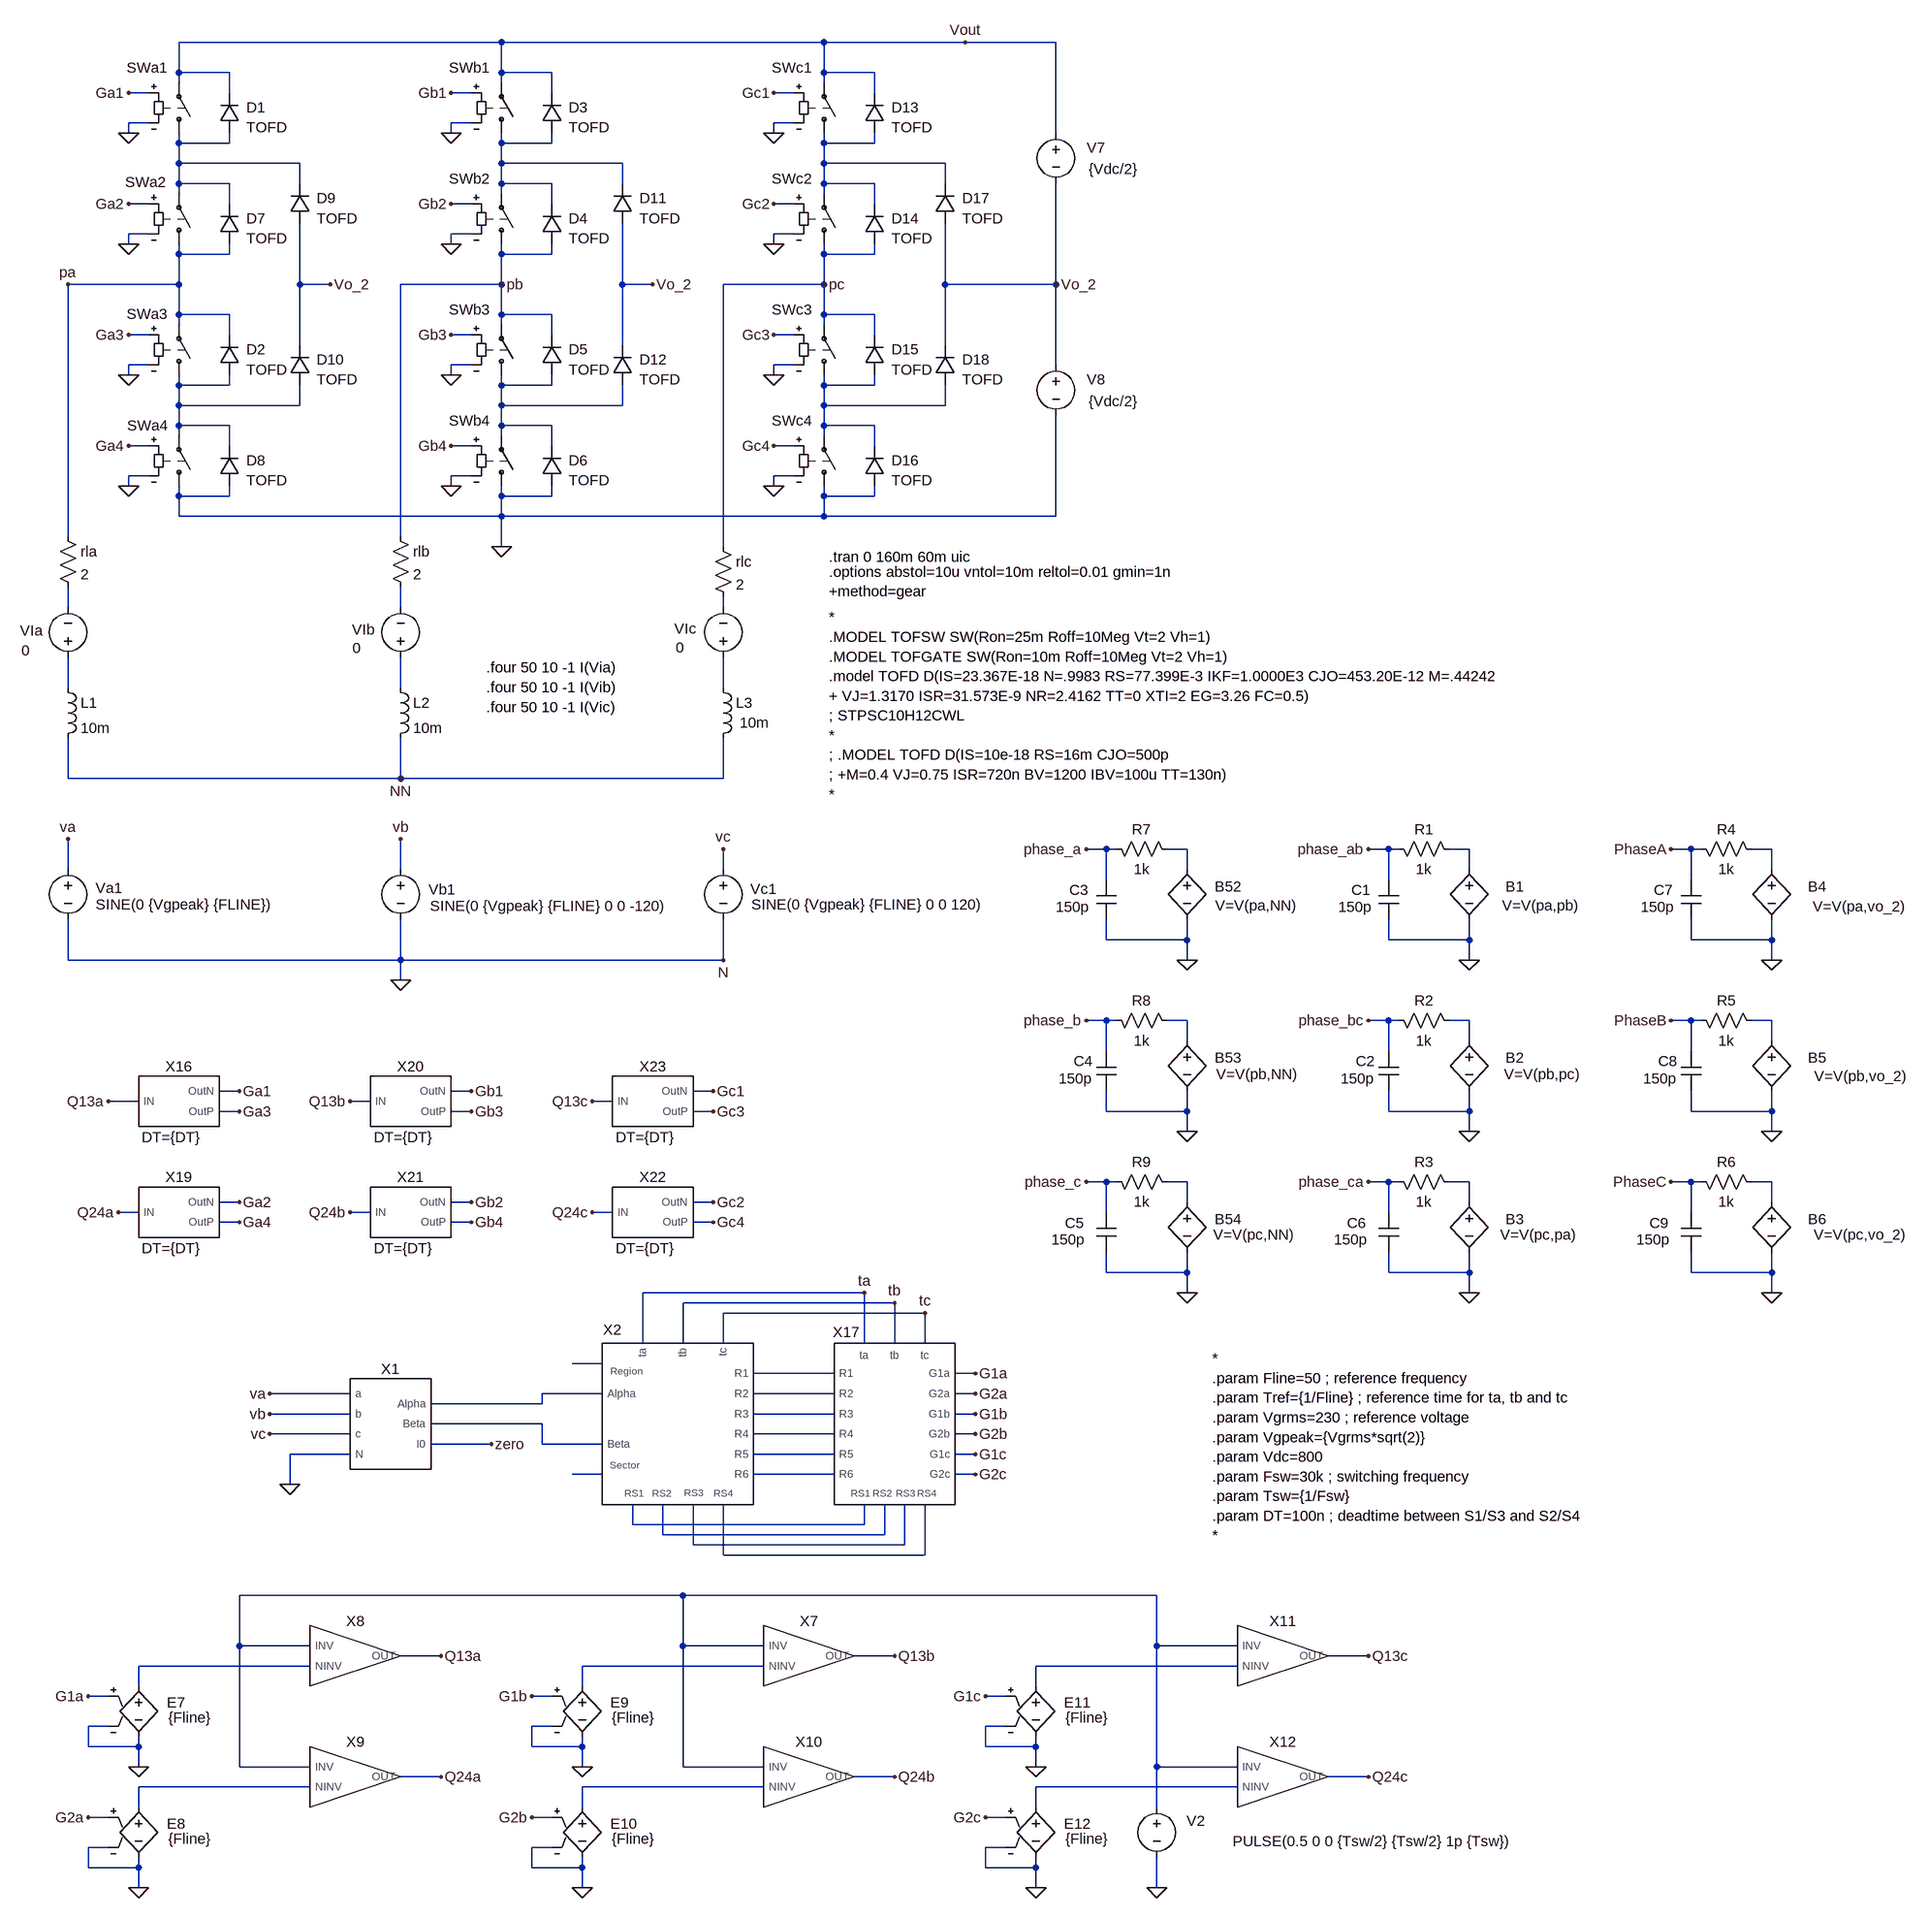
[diagram p0: schematic 3-phase NPC open loop inverter with switches - SVM.asc]
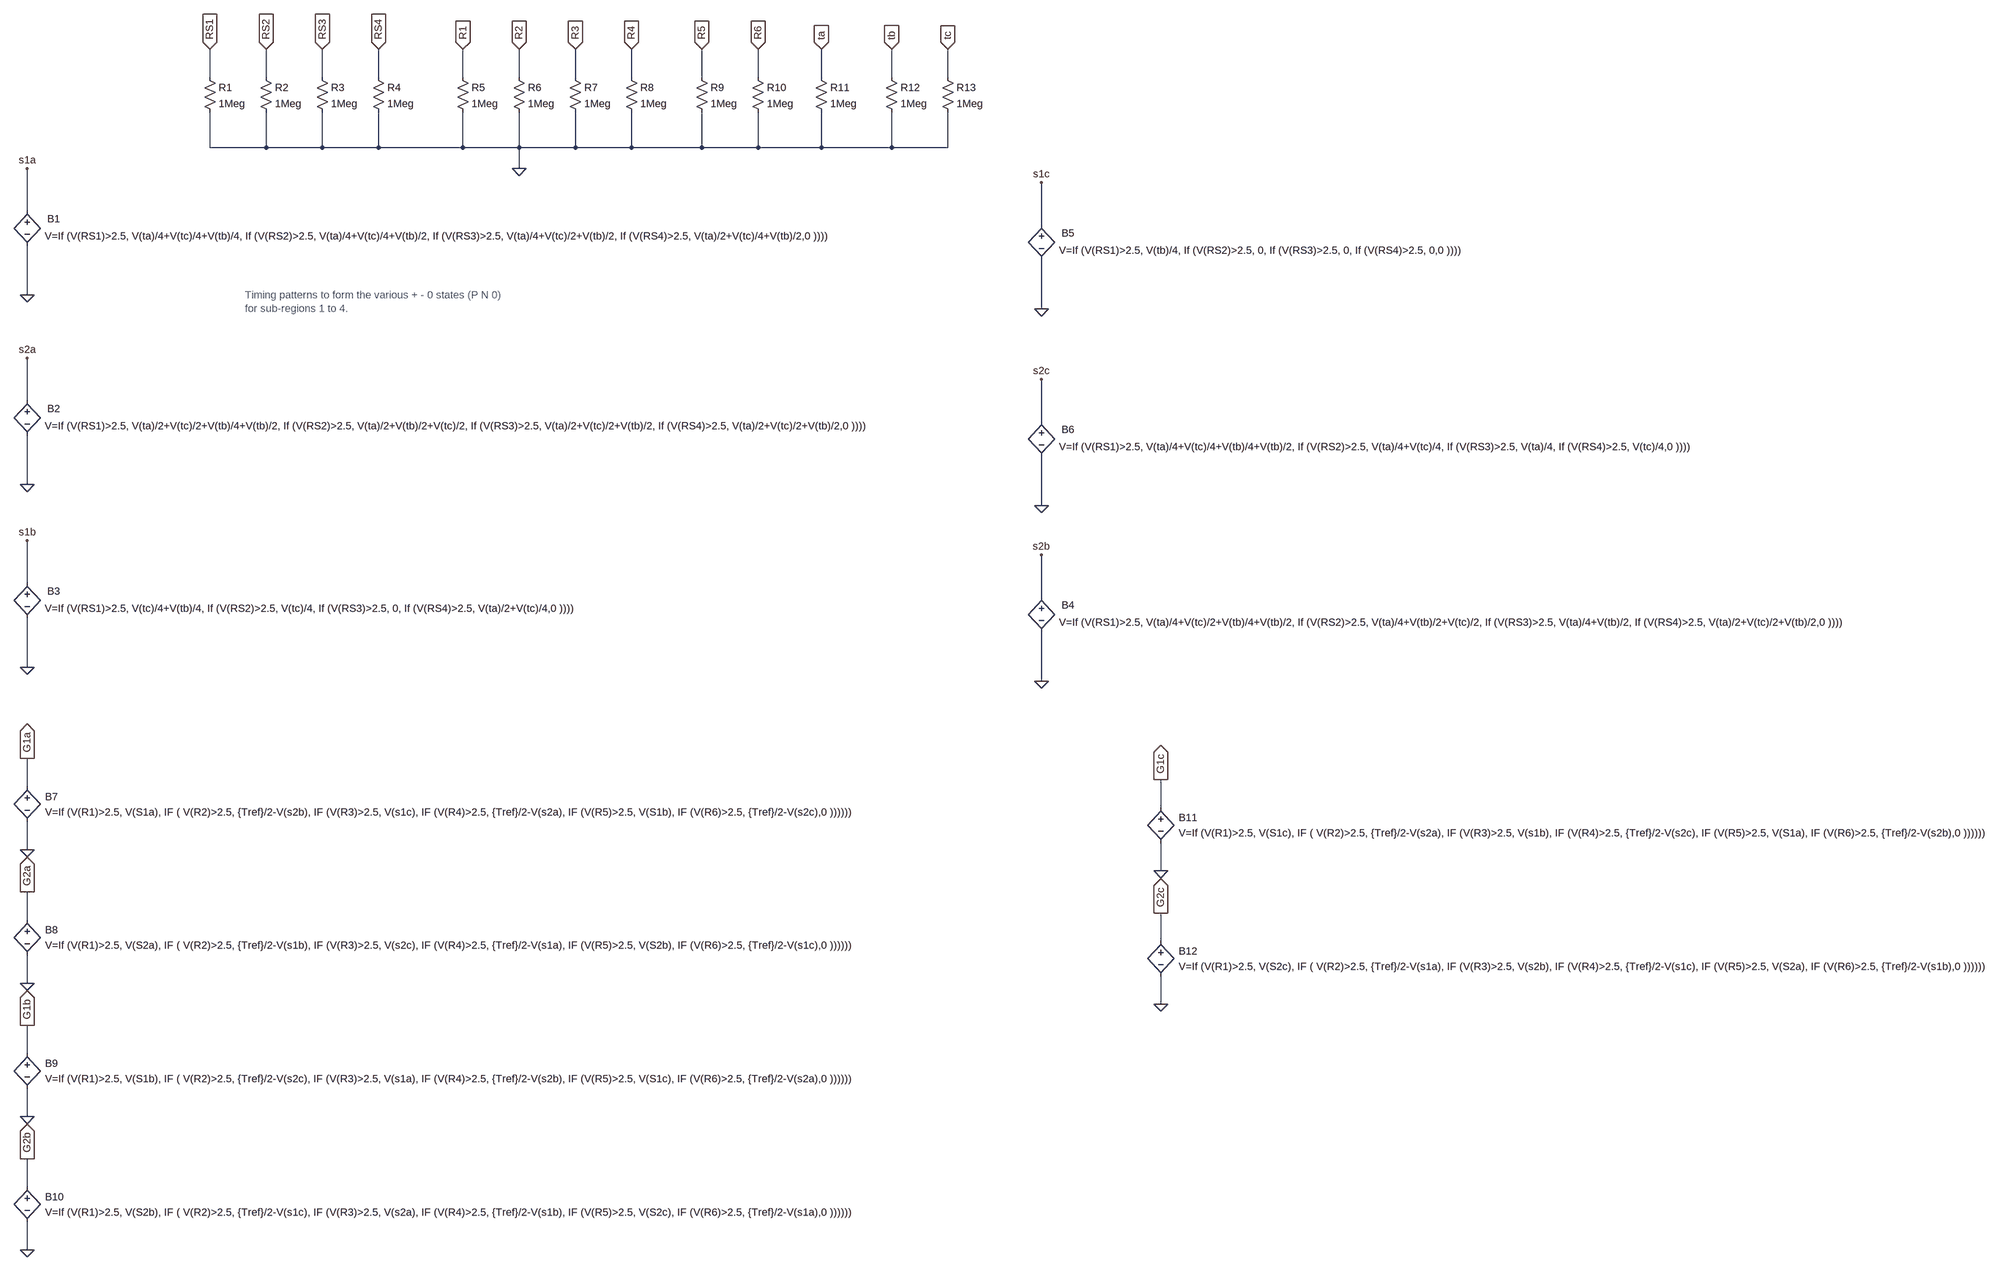
[diagram p1: sub-circuit timinggenerator.asc]
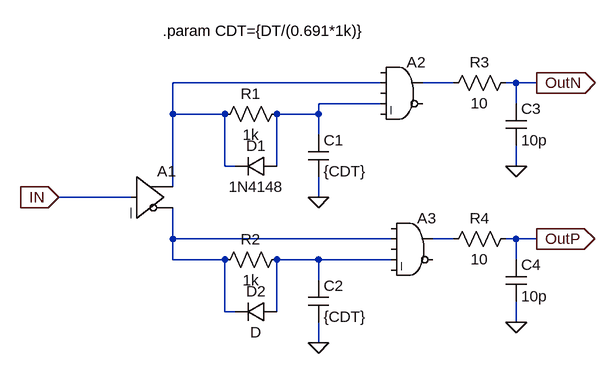
[diagram p2: sub-circuit dt_driver.asc]
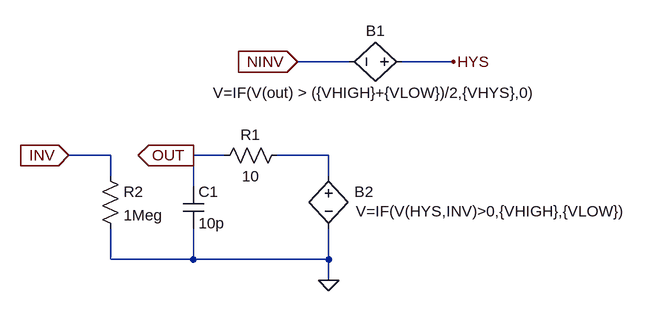
[diagram p3: sub-circuit comptof.asc]
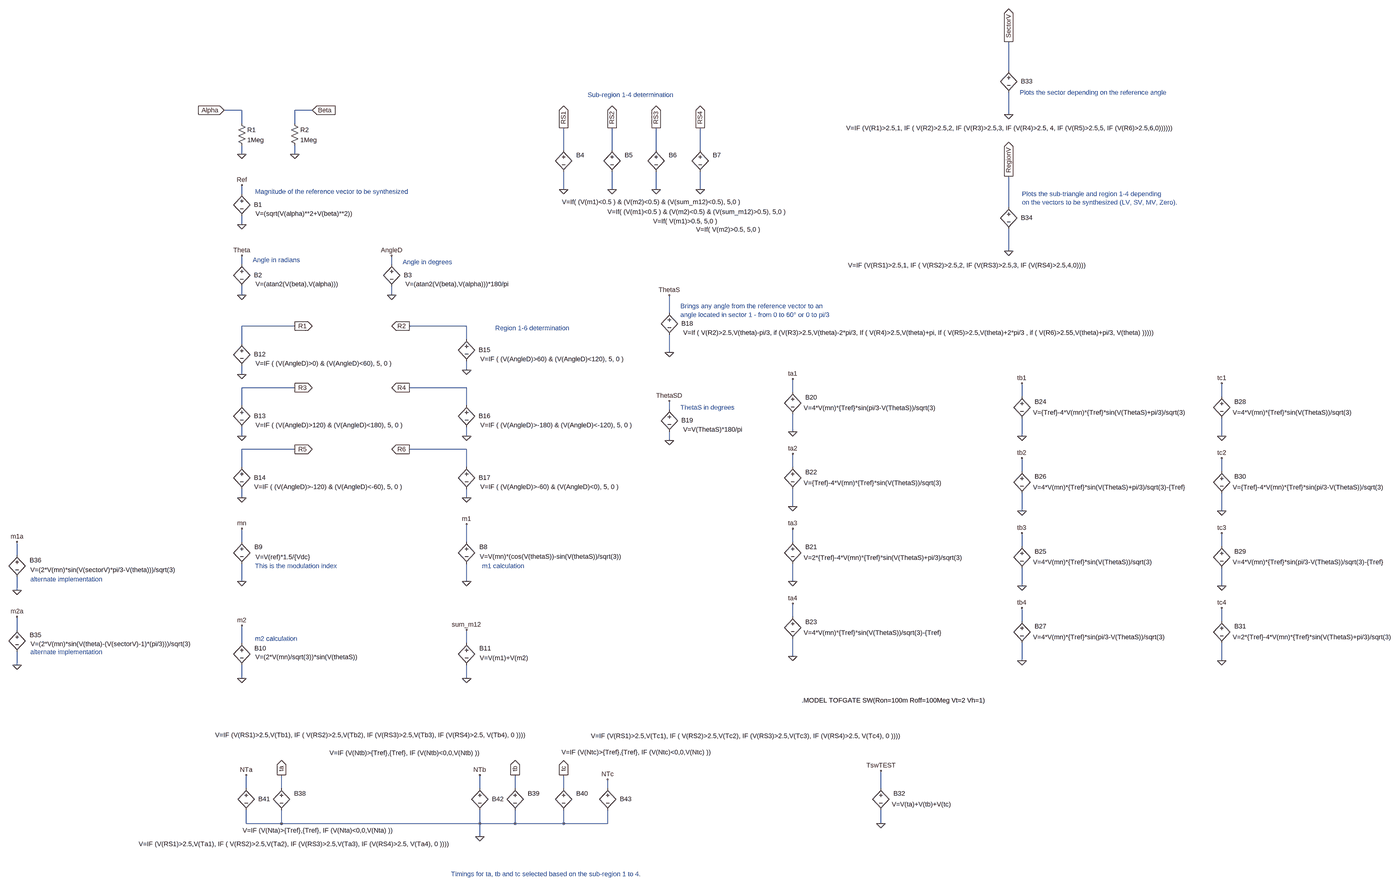
[diagram p4: sub-circuit alphabetatimings.asc, whole sheet]
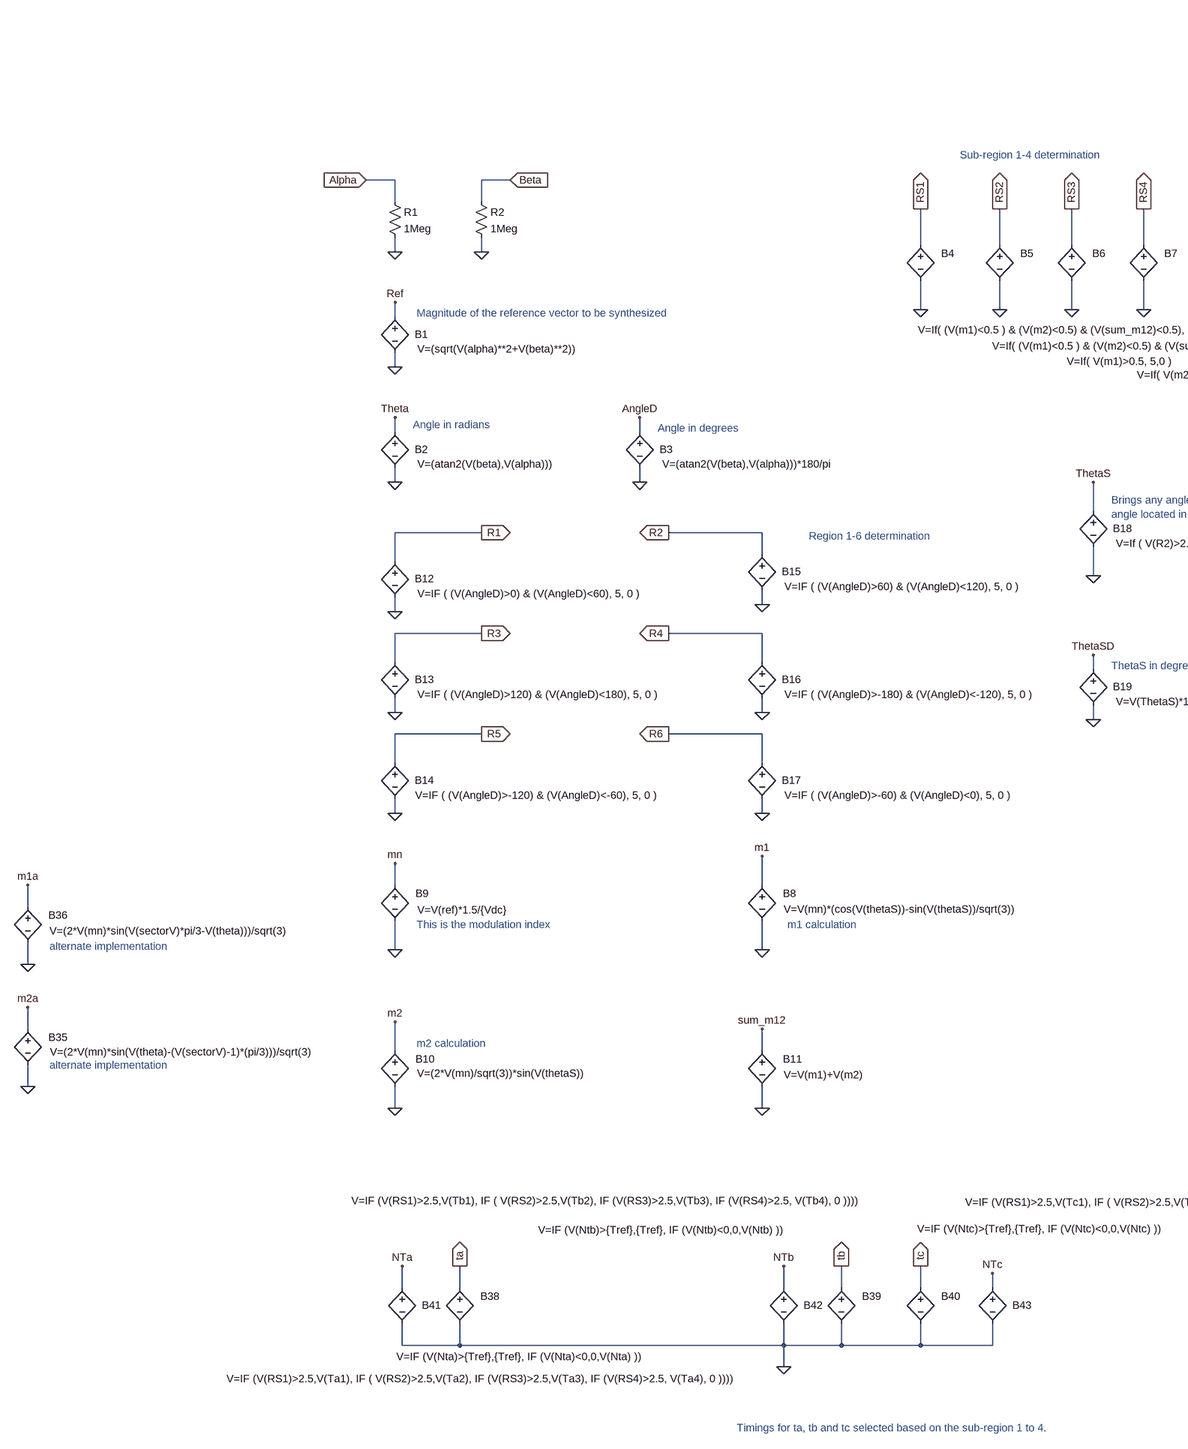
[diagram p5: sub-circuit alphabetatimings.asc, part, row 1 of 1, column 1 of 2]
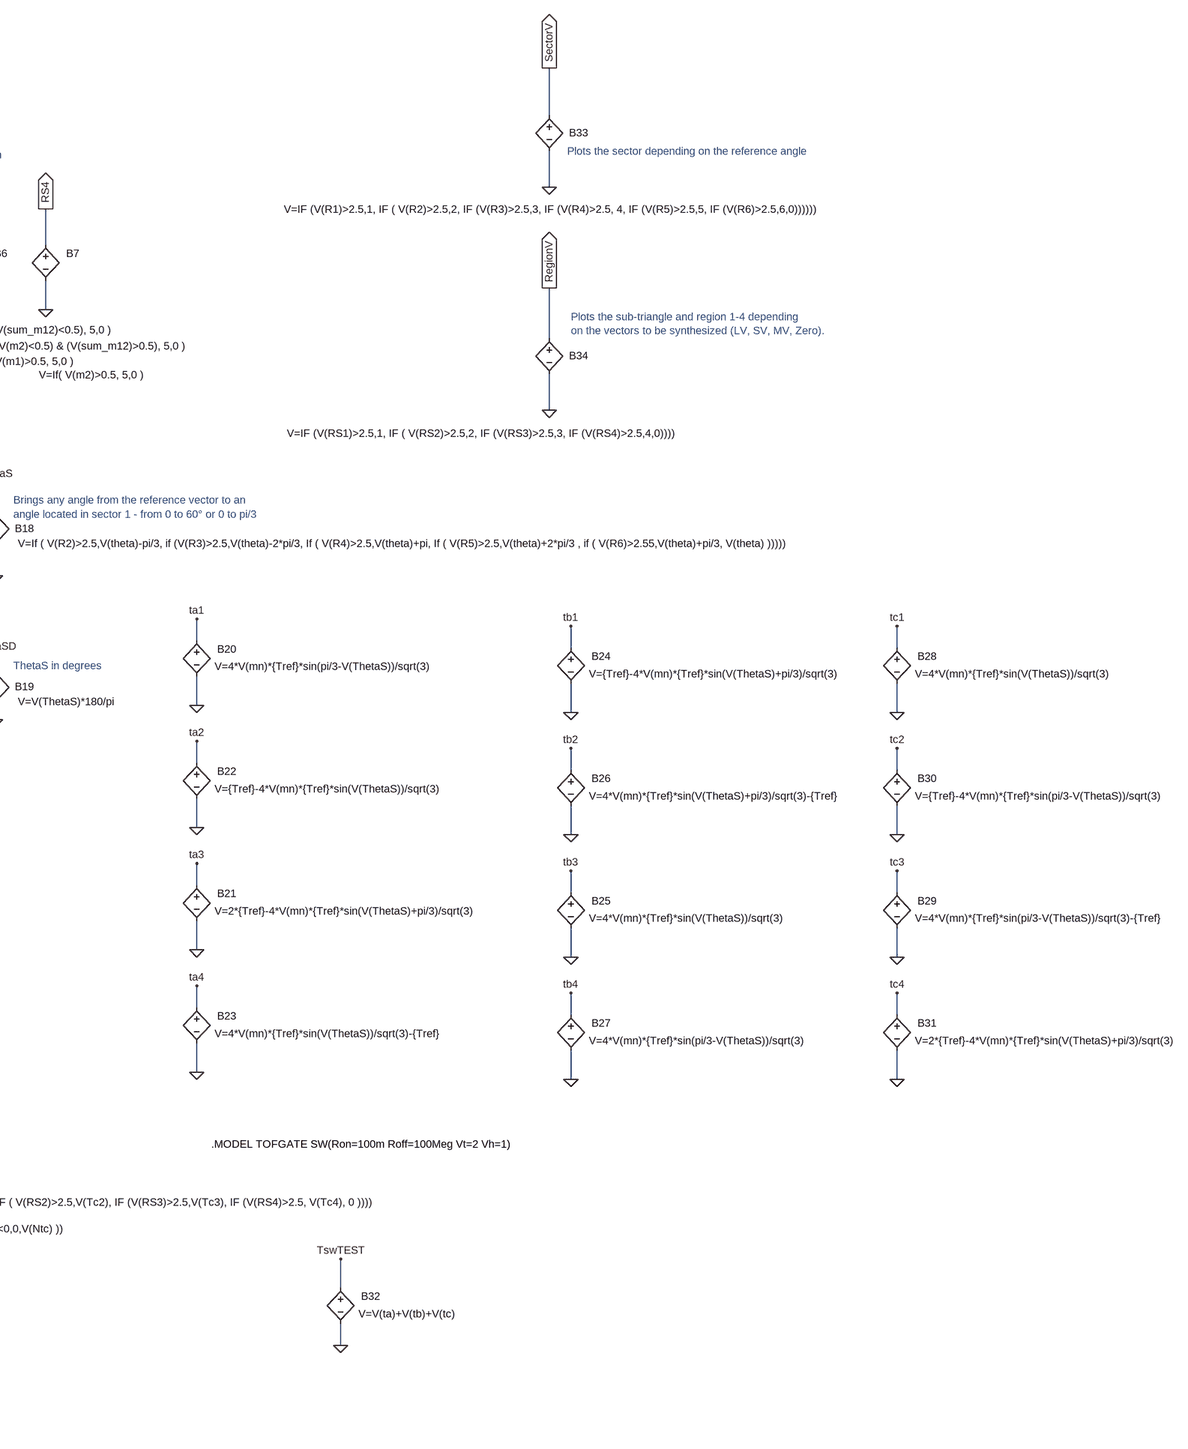
[diagram p6: sub-circuit alphabetatimings.asc, part, row 1 of 1, column 2 of 2]
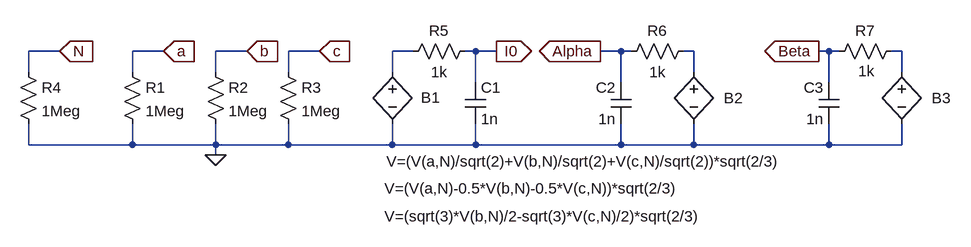
[diagram p7: sub-circuit abc_alpha_beta.asc]
3-phase NPC open loop inverter with switches - SVM.asc, the LTspice schematic file:
Version 4.1
SHEET 1 4820 6356
WIRE 496 -1056 -16 -1056
WIRE 1008 -1056 496 -1056
WIRE 1232 -1056 1008 -1056
WIRE 1376 -1056 1232 -1056
WIRE -16 -1008 -16 -1056
WIRE 64 -1008 -16 -1008
WIRE 496 -1008 496 -1056
WIRE 576 -1008 496 -1008
WIRE 1008 -1008 1008 -1056
WIRE 1088 -1008 1008 -1008
WIRE -16 -992 -16 -1008
WIRE 496 -992 496 -1008
WIRE 1008 -992 1008 -1008
WIRE -64 -976 -96 -976
WIRE 64 -976 64 -1008
WIRE 448 -976 416 -976
WIRE 576 -976 576 -1008
WIRE 960 -976 928 -976
WIRE 1088 -976 1088 -1008
WIRE -64 -928 -96 -928
WIRE 448 -928 416 -928
WIRE 960 -928 928 -928
WIRE -96 -912 -96 -928
WIRE 416 -912 416 -928
WIRE 928 -912 928 -928
WIRE 1376 -912 1376 -1056
WIRE -16 -896 -16 -912
WIRE 64 -896 64 -912
WIRE 64 -896 -16 -896
WIRE 496 -896 496 -912
WIRE 576 -896 576 -912
WIRE 576 -896 496 -896
WIRE 1008 -896 1008 -912
WIRE 1088 -896 1088 -912
WIRE 1088 -896 1008 -896
WIRE -16 -864 -16 -896
WIRE 176 -864 -16 -864
WIRE 496 -864 496 -896
WIRE 688 -864 496 -864
WIRE 1008 -864 1008 -896
WIRE 1200 -864 1008 -864
WIRE -16 -832 -16 -864
WIRE 64 -832 -16 -832
WIRE 176 -832 176 -864
WIRE 496 -832 496 -864
WIRE 576 -832 496 -832
WIRE 688 -832 688 -864
WIRE 1008 -832 1008 -864
WIRE 1088 -832 1008 -832
WIRE 1200 -832 1200 -864
WIRE -16 -816 -16 -832
WIRE 496 -816 496 -832
WIRE 1008 -816 1008 -832
WIRE -64 -800 -96 -800
WIRE 64 -800 64 -832
WIRE 448 -800 416 -800
WIRE 576 -800 576 -832
WIRE 960 -800 928 -800
WIRE 1088 -800 1088 -832
WIRE -64 -752 -96 -752
WIRE 448 -752 416 -752
WIRE 960 -752 928 -752
WIRE -96 -736 -96 -752
WIRE 416 -736 416 -752
WIRE 928 -736 928 -752
WIRE -16 -720 -16 -736
WIRE 64 -720 64 -736
WIRE 64 -720 -16 -720
WIRE 496 -720 496 -736
WIRE 576 -720 576 -736
WIRE 576 -720 496 -720
WIRE 1008 -720 1008 -736
WIRE 1088 -720 1088 -736
WIRE 1088 -720 1008 -720
WIRE -16 -672 -16 -720
WIRE -16 -672 -192 -672
WIRE 176 -672 176 -768
WIRE 224 -672 176 -672
WIRE 496 -672 496 -720
WIRE 496 -672 336 -672
WIRE 688 -672 688 -768
WIRE 736 -672 688 -672
WIRE 1008 -672 1008 -720
WIRE 1008 -672 848 -672
WIRE 1200 -672 1200 -768
WIRE 1376 -672 1376 -832
WIRE 1376 -672 1200 -672
WIRE -16 -624 -16 -672
WIRE 64 -624 -16 -624
WIRE 496 -624 496 -672
WIRE 576 -624 496 -624
WIRE 1008 -624 1008 -672
WIRE 1088 -624 1008 -624
WIRE -16 -608 -16 -624
WIRE 496 -608 496 -624
WIRE 1008 -608 1008 -624
WIRE -64 -592 -96 -592
WIRE 64 -592 64 -624
WIRE 448 -592 416 -592
WIRE 576 -592 576 -624
WIRE 960 -592 928 -592
WIRE 1088 -592 1088 -624
WIRE 176 -576 176 -672
WIRE 688 -576 688 -672
WIRE 1200 -576 1200 -672
WIRE -64 -544 -96 -544
WIRE 448 -544 416 -544
WIRE 960 -544 928 -544
WIRE 1376 -544 1376 -672
WIRE -96 -528 -96 -544
WIRE 416 -528 416 -544
WIRE 928 -528 928 -544
WIRE -16 -512 -16 -528
WIRE 64 -512 64 -528
WIRE 64 -512 -16 -512
WIRE 496 -512 496 -528
WIRE 576 -512 576 -528
WIRE 576 -512 496 -512
WIRE 1008 -512 1008 -528
WIRE 1088 -512 1088 -528
WIRE 1088 -512 1008 -512
WIRE -16 -480 -16 -512
WIRE 176 -480 176 -512
WIRE 176 -480 -16 -480
WIRE 496 -480 496 -512
WIRE 688 -480 688 -512
WIRE 688 -480 496 -480
WIRE 1008 -480 1008 -512
WIRE 1200 -480 1200 -512
WIRE 1200 -480 1008 -480
WIRE -16 -448 -16 -480
WIRE 64 -448 -16 -448
WIRE 496 -448 496 -480
WIRE 576 -448 496 -448
WIRE 1008 -448 1008 -480
WIRE 1088 -448 1008 -448
WIRE -16 -432 -16 -448
WIRE 496 -432 496 -448
WIRE 1008 -432 1008 -448
WIRE -64 -416 -96 -416
WIRE 64 -416 64 -448
WIRE 448 -416 416 -416
WIRE 576 -416 576 -448
WIRE 960 -416 928 -416
WIRE 1088 -416 1088 -448
WIRE -64 -368 -96 -368
WIRE 448 -368 416 -368
WIRE 960 -368 928 -368
WIRE -96 -352 -96 -368
WIRE 416 -352 416 -368
WIRE 928 -352 928 -368
WIRE -16 -336 -16 -352
WIRE 64 -336 64 -352
WIRE 64 -336 -16 -336
WIRE 496 -336 496 -352
WIRE 576 -336 576 -352
WIRE 576 -336 496 -336
WIRE 1008 -336 1008 -352
WIRE 1088 -336 1088 -352
WIRE 1088 -336 1008 -336
WIRE -16 -304 -16 -336
WIRE 496 -304 496 -336
WIRE 496 -304 -16 -304
WIRE 1008 -304 1008 -336
WIRE 1008 -304 496 -304
WIRE 1376 -304 1376 -464
WIRE 1376 -304 1008 -304
WIRE -192 -272 -192 -672
WIRE 336 -272 336 -672
WIRE 496 -256 496 -304
WIRE 848 -256 848 -672
WIRE -192 -160 -192 -192
WIRE 336 -160 336 -192
WIRE 848 -160 848 -176
WIRE -192 -32 -192 -80
WIRE 336 -32 336 -80
WIRE 848 -32 848 -80
WIRE -192 112 -192 48
WIRE 336 112 336 48
WIRE 336 112 -192 112
WIRE 848 112 848 48
WIRE 848 112 336 112
WIRE 1456 224 1424 224
WIRE 1472 224 1456 224
WIRE 1584 224 1552 224
WIRE 1904 224 1872 224
WIRE 1920 224 1904 224
WIRE 2032 224 2000 224
WIRE 2384 224 2352 224
WIRE 2400 224 2384 224
WIRE 2512 224 2480 224
WIRE -192 256 -192 208
WIRE 336 256 336 208
WIRE 848 256 848 224
WIRE 1584 256 1584 224
WIRE 2032 256 2032 224
WIRE 2512 256 2512 224
WIRE 1456 272 1456 224
WIRE 1904 272 1904 224
WIRE 2384 272 2384 224
WIRE 1456 368 1456 336
WIRE 1584 368 1584 336
WIRE 1584 368 1456 368
WIRE 1904 368 1904 336
WIRE 2032 368 2032 336
WIRE 2032 368 1904 368
WIRE 2384 368 2384 336
WIRE 2512 368 2512 336
WIRE 2512 368 2384 368
WIRE -192 400 -192 336
WIRE 336 400 336 336
WIRE 336 400 -192 400
WIRE 848 400 848 336
WIRE 848 400 336 400
WIRE 1584 400 1584 368
WIRE 2032 400 2032 368
WIRE 2512 400 2512 368
WIRE 336 432 336 400
WIRE 1456 496 1424 496
WIRE 1472 496 1456 496
WIRE 1584 496 1552 496
WIRE 1904 496 1872 496
WIRE 1920 496 1904 496
WIRE 2032 496 2000 496
WIRE 2384 496 2352 496
WIRE 2400 496 2384 496
WIRE 2512 496 2480 496
WIRE 1584 528 1584 496
WIRE 2032 528 2032 496
WIRE 2512 528 2512 496
WIRE 1456 544 1456 496
WIRE 1904 544 1904 496
WIRE 2384 544 2384 496
WIRE 80 608 48 608
WIRE 448 608 416 608
WIRE 832 608 800 608
WIRE -80 624 -128 624
WIRE 288 624 256 624
WIRE 672 624 640 624
WIRE 80 640 48 640
WIRE 448 640 416 640
WIRE 832 640 800 640
WIRE 1456 640 1456 608
WIRE 1584 640 1584 608
WIRE 1584 640 1456 640
WIRE 1904 640 1904 608
WIRE 2032 640 2032 608
WIRE 2032 640 1904 640
WIRE 2384 640 2384 608
WIRE 2512 640 2512 608
WIRE 2512 640 2384 640
WIRE 1584 672 1584 640
WIRE 2032 672 2032 640
WIRE 2512 672 2512 640
WIRE 1456 752 1424 752
WIRE 1472 752 1456 752
WIRE 1584 752 1552 752
WIRE 1904 752 1872 752
WIRE 1920 752 1904 752
WIRE 2032 752 2000 752
WIRE 2384 752 2352 752
WIRE 2400 752 2384 752
WIRE 2512 752 2480 752
WIRE 80 784 48 784
WIRE 448 784 416 784
WIRE 832 784 800 784
WIRE 1584 784 1584 752
WIRE 2032 784 2032 752
WIRE 2512 784 2512 752
WIRE -80 800 -112 800
WIRE 288 800 256 800
WIRE 672 800 640 800
WIRE 1456 800 1456 752
WIRE 1904 800 1904 752
WIRE 2384 800 2384 752
WIRE 80 816 48 816
WIRE 448 816 416 816
WIRE 832 816 800 816
WIRE 1456 896 1456 864
WIRE 1584 896 1584 864
WIRE 1584 896 1456 896
WIRE 1904 896 1904 864
WIRE 2032 896 2032 864
WIRE 2032 896 1904 896
WIRE 2384 896 2384 864
WIRE 2512 896 2512 864
WIRE 2512 896 2384 896
WIRE 1072 928 720 928
WIRE 1584 928 1584 896
WIRE 2032 928 2032 896
WIRE 2512 928 2512 896
WIRE 1120 944 784 944
WIRE 1168 960 848 960
WIRE 720 1008 720 928
WIRE 784 1008 784 944
WIRE 848 1008 848 960
WIRE 1072 1008 1072 928
WIRE 1120 1008 1120 944
WIRE 1168 1008 1168 960
WIRE 656 1040 608 1040
WIRE 1024 1056 896 1056
WIRE 1248 1056 1216 1056
WIRE 256 1088 128 1088
WIRE 656 1088 560 1088
WIRE 1024 1088 896 1088
WIRE 1248 1088 1216 1088
WIRE 560 1104 560 1088
WIRE 560 1104 384 1104
WIRE 256 1120 128 1120
WIRE 1024 1120 896 1120
WIRE 1248 1120 1216 1120
WIRE 560 1136 384 1136
WIRE 256 1152 128 1152
WIRE 1024 1152 896 1152
WIRE 1248 1152 1216 1152
WIRE 480 1168 384 1168
WIRE 560 1168 560 1136
WIRE 656 1168 560 1168
WIRE 256 1184 160 1184
WIRE 1024 1184 896 1184
WIRE 1248 1184 1216 1184
WIRE 656 1216 608 1216
WIRE 1024 1216 896 1216
WIRE 1248 1216 1216 1216
WIRE 160 1232 160 1184
WIRE 704 1296 704 1264
WIRE 1072 1296 1072 1264
WIRE 1072 1296 704 1296
WIRE 752 1312 752 1264
WIRE 1104 1312 1104 1264
WIRE 1104 1312 752 1312
WIRE 800 1328 800 1264
WIRE 1136 1328 1136 1264
WIRE 1136 1328 800 1328
WIRE 848 1344 848 1264
WIRE 1168 1344 1168 1264
WIRE 1168 1344 848 1344
WIRE 784 1408 80 1408
WIRE 1536 1408 784 1408
WIRE 80 1488 80 1408
WIRE 192 1488 80 1488
WIRE 784 1488 784 1408
WIRE 912 1488 784 1488
WIRE 1536 1488 1536 1408
WIRE 1664 1488 1536 1488
WIRE 400 1504 336 1504
WIRE 1120 1504 1056 1504
WIRE 1872 1504 1808 1504
WIRE 192 1520 -80 1520
WIRE 912 1520 624 1520
WIRE 1664 1520 1344 1520
WIRE -80 1552 -80 1520
WIRE 624 1552 624 1520
WIRE 1344 1552 1344 1520
WIRE -128 1568 -160 1568
WIRE 576 1568 544 1568
WIRE 1296 1568 1264 1568
WIRE -128 1616 -160 1616
WIRE 576 1616 544 1616
WIRE 1296 1616 1264 1616
WIRE -160 1648 -160 1616
WIRE -80 1648 -80 1632
WIRE -80 1648 -160 1648
WIRE 544 1648 544 1616
WIRE 624 1648 624 1632
WIRE 624 1648 544 1648
WIRE 1264 1648 1264 1616
WIRE 1344 1648 1344 1632
WIRE 1344 1648 1264 1648
WIRE -80 1680 -80 1648
WIRE 80 1680 80 1488
WIRE 192 1680 80 1680
WIRE 624 1680 624 1648
WIRE 784 1680 784 1488
WIRE 912 1680 784 1680
WIRE 1344 1680 1344 1648
WIRE 1536 1680 1536 1488
WIRE 1664 1680 1536 1680
WIRE 400 1696 336 1696
WIRE 1120 1696 1056 1696
WIRE 1872 1696 1808 1696
WIRE 192 1712 -80 1712
WIRE 912 1712 624 1712
WIRE 1664 1712 1344 1712
WIRE -80 1744 -80 1712
WIRE 624 1744 624 1712
WIRE 1344 1744 1344 1712
WIRE 1536 1744 1536 1680
WIRE -128 1760 -160 1760
WIRE 576 1760 544 1760
WIRE 1296 1760 1264 1760
WIRE -128 1808 -160 1808
WIRE 576 1808 544 1808
WIRE 1296 1808 1264 1808
WIRE -160 1840 -160 1808
WIRE -80 1840 -80 1824
WIRE -80 1840 -160 1840
WIRE 544 1840 544 1808
WIRE 624 1840 624 1824
WIRE 624 1840 544 1840
WIRE 1264 1840 1264 1808
WIRE 1344 1840 1344 1824
WIRE 1344 1840 1264 1840
WIRE -80 1872 -80 1840
WIRE 624 1872 624 1840
WIRE 1344 1872 1344 1840
WIRE 1536 1872 1536 1824
FLAG 1232 -1056 Vout
FLAG -96 -352 0
FLAG -96 -528 0
FLAG -96 -736 0
FLAG -96 -912 0
FLAG 1376 -672 Vo_2
FLAG 224 -672 Vo_2
FLAG 416 -352 0
FLAG 416 -528 0
FLAG 416 -736 0
FLAG 416 -912 0
FLAG 736 -672 Vo_2
FLAG 928 -352 0
FLAG 928 -528 0
FLAG 928 -736 0
FLAG 928 -912 0
FLAG -96 -976 Ga1
FLAG -96 -800 Ga2
FLAG -96 -592 Ga3
FLAG -96 -416 Ga4
FLAG 416 -976 Gb1
FLAG 416 -800 Gb2
FLAG 416 -592 Gb3
FLAG 416 -416 Gb4
FLAG 928 -976 Gc1
FLAG 928 -800 Gc2
FLAG 928 -592 Gc3
FLAG 928 -416 Gc4
FLAG 496 -256 0
FLAG 1584 400 0
FLAG -192 -672 pa
FLAG 496 -672 pb
FLAG 1008 -672 pc
FLAG 336 112 NN
FLAG 1424 224 phase_a
FLAG 1584 672 0
FLAG 1424 496 phase_b
FLAG 1584 928 0
FLAG 1424 752 phase_c
FLAG 128 1088 va
FLAG 128 1120 vb
FLAG 128 1152 vc
FLAG 480 1168 zero
FLAG -192 208 va
FLAG 336 208 vb
FLAG 848 224 vc
FLAG 848 400 N
FLAG 1248 1056 G1a
FLAG 1248 1088 G2a
FLAG 1248 1120 G1b
FLAG 1248 1152 G2b
FLAG 1248 1184 G1c
FLAG 1248 1216 G2c
FLAG 80 640 Ga3
FLAG 80 608 Ga1
FLAG 80 816 Ga4
FLAG 80 784 Ga2
FLAG -128 624 Q13a
FLAG -112 800 Q24a
FLAG 448 640 Gb3
FLAG 448 608 Gb1
FLAG 448 816 Gb4
FLAG 448 784 Gb2
FLAG 256 624 Q13b
FLAG 256 800 Q24b
FLAG 832 640 Gc3
FLAG 832 608 Gc1
FLAG 832 816 Gc4
FLAG 832 784 Gc2
FLAG 640 624 Q13c
FLAG 640 800 Q24c
FLAG 1536 1872 0
FLAG 400 1504 Q13a
FLAG 400 1696 Q24a
FLAG 1120 1504 Q13b
FLAG 1120 1696 Q24b
FLAG 1872 1504 Q13c
FLAG 1872 1696 Q24c
FLAG -80 1680 0
FLAG -160 1568 G1a
FLAG -80 1872 0
FLAG -160 1760 G2a
FLAG 624 1680 0
FLAG 544 1568 G1b
FLAG 624 1872 0
FLAG 544 1760 G2b
FLAG 1344 1680 0
FLAG 1264 1568 G1c
FLAG 1344 1872 0
FLAG 1264 1760 G2c
FLAG 336 432 0
FLAG 2032 400 0
FLAG 1872 224 phase_ab
FLAG 2032 672 0
FLAG 1872 496 phase_bc
FLAG 2032 928 0
FLAG 1872 752 phase_ca
FLAG 160 1232 0
FLAG 1072 928 ta
FLAG 1120 944 tb
FLAG 1168 960 tc
FLAG 2512 400 0
FLAG 2352 224 PhaseA
FLAG 2512 672 0
FLAG 2352 496 PhaseB
FLAG 2512 928 0
FLAG 2352 752 PhaseC
SYMBOL res -208 -288 R0
SYMATTR InstName rla
SYMATTR Value 2
SYMBOL res 320 -288 R0
SYMATTR InstName rlb
SYMATTR Value 2
SYMBOL res 832 -272 R0
SYMATTR InstName rlc
SYMATTR Value 2
SYMBOL voltage -192 -64 R180
WINDOW 0 40 59 Left 2
WINDOW 3 60 27 Left 2
WINDOW 123 0 0 Left 0
WINDOW 39 0 0 Left 0
SYMATTR InstName VIa
SYMATTR Value 0
SYMBOL voltage 336 -64 R180
WINDOW 0 41 60 Left 2
WINDOW 3 63 31 Left 2
WINDOW 123 0 0 Left 0
WINDOW 39 0 0 Left 0
SYMATTR InstName VIb
SYMATTR Value 0
SYMBOL voltage 848 -64 R180
WINDOW 0 43 62 Left 2
WINDOW 3 62 32 Left 2
WINDOW 123 0 0 Left 0
WINDOW 39 0 0 Left 0
SYMATTR InstName VIc
SYMATTR Value 0
SYMBOL sw -16 -896 M180
WINDOW 3 47 44 Invisible 2
WINDOW 0 -83 120 Left 2
SYMATTR Value TOFSW
SYMATTR InstName SWa1
SYMBOL diode 48 -912 M180
WINDOW 0 43 41 Left 2
WINDOW 3 43 9 Left 2
SYMATTR InstName D1
SYMATTR Value TOFD
SYMBOL sw -16 -720 M180
WINDOW 3 47 44 Invisible 2
WINDOW 0 -85 114 Left 2
SYMATTR Value TOFSW
SYMATTR InstName SWa2
SYMBOL diode 48 -736 M180
WINDOW 0 43 41 Left 2
WINDOW 3 43 9 Left 2
SYMATTR InstName D7
SYMATTR Value TOFD
SYMBOL sw -16 -512 M180
WINDOW 3 47 44 Invisible 2
WINDOW 0 -83 113 Left 2
SYMATTR Value TOFSW
SYMATTR InstName SWa3
SYMBOL diode 48 -528 M180
WINDOW 0 43 41 Left 2
WINDOW 3 43 9 Left 2
SYMATTR InstName D2
SYMATTR Value TOFD
SYMBOL sw -16 -336 M180
WINDOW 3 47 44 Invisible 2
WINDOW 0 -82 112 Left 2
SYMATTR Value TOFSW
SYMATTR InstName SWa4
SYMBOL diode 48 -352 M180
WINDOW 0 43 41 Left 2
WINDOW 3 43 9 Left 2
SYMATTR InstName D8
SYMATTR Value TOFD
SYMBOL diode 160 -768 M180
WINDOW 0 43 41 Left 2
WINDOW 3 43 9 Left 2
SYMATTR InstName D9
SYMATTR Value TOFD
SYMBOL diode 160 -512 M180
WINDOW 0 43 41 Left 2
WINDOW 3 43 9 Left 2
SYMATTR InstName D10
SYMATTR Value TOFD
SYMBOL diode 560 -912 M180
WINDOW 0 43 41 Left 2
WINDOW 3 43 9 Left 2
SYMATTR InstName D3
SYMATTR Value TOFD
SYMBOL diode 560 -736 M180
WINDOW 0 43 41 Left 2
WINDOW 3 43 9 Left 2
SYMATTR InstName D4
SYMATTR Value TOFD
SYMBOL diode 560 -528 M180
WINDOW 0 43 41 Left 2
WINDOW 3 43 9 Left 2
SYMATTR InstName D5
SYMATTR Value TOFD
SYMBOL diode 560 -352 M180
WINDOW 0 43 41 Left 2
WINDOW 3 43 9 Left 2
SYMATTR InstName D6
SYMATTR Value TOFD
SYMBOL diode 672 -768 M180
WINDOW 0 43 41 Left 2
WINDOW 3 43 9 Left 2
SYMATTR InstName D11
SYMATTR Value TOFD
SYMBOL diode 672 -512 M180
WINDOW 0 43 41 Left 2
WINDOW 3 43 9 Left 2
SYMATTR InstName D12
SYMATTR Value TOFD
SYMBOL diode 1072 -912 M180
WINDOW 0 43 41 Left 2
WINDOW 3 43 9 Left 2
SYMATTR InstName D13
SYMATTR Value TOFD
SYMBOL diode 1072 -736 M180
WINDOW 0 43 41 Left 2
WINDOW 3 43 9 Left 2
SYMATTR InstName D14
SYMATTR Value TOFD
SYMBOL diode 1072 -528 M180
WINDOW 0 43 41 Left 2
WINDOW 3 43 9 Left 2
SYMATTR InstName D15
SYMATTR Value TOFD
SYMBOL diode 1072 -352 M180
WINDOW 0 43 41 Left 2
WINDOW 3 43 9 Left 2
SYMATTR InstName D16
SYMATTR Value TOFD
SYMBOL diode 1184 -768 M180
WINDOW 0 43 41 Left 2
WINDOW 3 43 9 Left 2
SYMATTR InstName D17
SYMATTR Value TOFD
SYMBOL diode 1184 -512 M180
WINDOW 0 43 41 Left 2
WINDOW 3 43 9 Left 2
SYMATTR InstName D18
SYMATTR Value TOFD
SYMBOL sw 496 -896 M180
WINDOW 3 47 44 Invisible 2
WINDOW 0 -83 120 Left 2
SYMATTR Value TOFSW
SYMATTR InstName SWb1
SYMBOL sw 496 -720 M180
WINDOW 3 47 44 Invisible 2
WINDOW 0 -83 120 Left 2
SYMATTR Value TOFSW
SYMATTR InstName SWb2
SYMBOL sw 496 -512 M180
WINDOW 3 47 44 Invisible 2
WINDOW 0 -83 120 Left 2
SYMATTR Value TOFSW
SYMATTR InstName SWb3
SYMBOL sw 496 -336 M180
WINDOW 3 47 44 Invisible 2
WINDOW 0 -83 120 Left 2
SYMATTR Value TOFSW
SYMATTR InstName SWb4
SYMBOL sw 1008 -896 M180
WINDOW 3 47 44 Invisible 2
WINDOW 0 -83 120 Left 2
SYMATTR Value TOFSW
SYMATTR InstName SWc1
SYMBOL sw 1008 -720 M180
WINDOW 3 47 44 Invisible 2
WINDOW 0 -83 120 Left 2
SYMATTR Value TOFSW
SYMATTR InstName SWc2
SYMBOL sw 1008 -512 M180
WINDOW 3 47 44 Invisible 2
WINDOW 0 -83 120 Left 2
SYMATTR Value TOFSW
SYMATTR InstName SWc3
SYMBOL sw 1008 -336 M180
WINDOW 3 47 44 Invisible 2
WINDOW 0 -83 120 Left 2
SYMATTR Value TOFSW
SYMATTR InstName SWc4
SYMBOL voltage 1376 -928 R0
WINDOW 0 49 39 Left 2
WINDOW 3 52 73 Left 2
SYMATTR InstName V7
SYMATTR Value {Vdc/2}
SYMBOL voltage 1376 -560 R0
WINDOW 0 49 39 Left 2
WINDOW 3 52 73 Left 2
SYMATTR InstName V8
SYMATTR Value {Vdc/2}
SYMBOL ind -208 -48 R0
SYMATTR InstName L1
SYMATTR Value 10m
SYMBOL ind 320 -48 R0
SYMATTR InstName L2
SYMATTR Value 10m
SYMBOL ind 832 -48 R0
WINDOW 3 42 71 Left 2
SYMATTR Value 10m
SYMATTR InstName L3
SYMBOL res 1456 208 M90
WINDOW 0 0 56 VBottom 2
WINDOW 3 32 56 VTop 2
SYMATTR InstName R7
SYMATTR Value 1k
SYMBOL cap 1472 272 M0
WINDOW 0 44 17 Left 2
WINDOW 3 42 44 Left 2
SYMATTR InstName C3
SYMATTR Value 150p
SYMBOL bv 1584 240 M0
WINDOW 0 -87 43 Left 2
WINDOW 3 -175 73 Left 2
SYMATTR InstName B52
SYMATTR Value V=V(pa,NN)
SYMBOL res 1456 480 M90
WINDOW 0 0 56 VBottom 2
WINDOW 3 32 56 VTop 2
SYMATTR InstName R8
SYMATTR Value 1k
SYMBOL cap 1472 544 M0
WINDOW 0 37 16 Left 2
WINDOW 3 38 44 Left 2
SYMATTR InstName C4
SYMATTR Value 150p
SYMBOL bv 1584 512 M0
WINDOW 0 -87 43 Left 2
WINDOW 3 -177 69 Left 2
SYMATTR InstName B53
SYMATTR Value V=V(pb,NN)
SYMBOL res 1456 736 M90
WINDOW 0 0 56 VBottom 2
WINDOW 3 32 56 VTop 2
SYMATTR InstName R9
SYMATTR Value 1k
SYMBOL cap 1472 800 M0
WINDOW 0 51 17 Left 2
WINDOW 3 49 43 Left 2
SYMATTR InstName C5
SYMATTR Value 150p
SYMBOL bv 1584 768 M0
WINDOW 0 -87 43 Left 2
WINDOW 3 -171 68 Left 2
SYMATTR InstName B54
SYMATTR Value V=V(pc,NN)
SYMBOL voltage -192 240 R0
WINDOW 0 44 46 Left 2
WINDOW 3 44 72 Left 2
WINDOW 123 0 0 Left 0
WINDOW 39 0 0 Left 0
SYMATTR InstName Va1
SYMATTR Value SINE(0 {Vgpeak} {FLINE})
SYMBOL voltage 336 240 R0
WINDOW 0 44 48 Left 2
WINDOW 3 47 74 Left 2
WINDOW 123 0 0 Left 0
WINDOW 39 0 0 Left 0
SYMATTR InstName Vb1
SYMATTR Value SINE(0 {Vgpeak} {FLINE} 0 0 -120)
SYMBOL voltage 848 240 R0
WINDOW 0 43 47 Left 2
WINDOW 3 45 72 Left 2
WINDOW 123 0 0 Left 0
WINDOW 39 0 0 Left 0
SYMATTR InstName Vc1
SYMATTR Value SINE(0 {Vgpeak} {FLINE} 0 0 120)
SYMBOL TOF\\3Phase\\SVM\\TimingGenerator 1088 1136 R0
WINDOW 0 -45 -130 Bottom 2
SYMATTR InstName X17
SYMATTR SpiceLine Tsw={Tsw} Tref={Tref}
SYMBOL TOF\\3Phase\\SVM\\DT_driver -16 624 R0
WINDOW 39 -11 73 Bottom 2
SYMATTR SpiceLine DT={DT}
SYMATTR InstName X16
SYMBOL TOF\\3Phase\\SVM\\DT_driver -16 800 R0
WINDOW 39 -11 73 Bottom 2
SYMATTR SpiceLine DT={DT}
SYMATTR InstName X19
SYMBOL TOF\\3Phase\\SVM\\DT_driver 352 624 R0
WINDOW 39 -11 73 Bottom 2
SYMATTR SpiceLine DT={DT}
SYMATTR InstName X20
SYMBOL TOF\\3Phase\\SVM\\DT_driver 352 800 R0
WINDOW 39 -11 73 Bottom 2
SYMATTR SpiceLine DT={DT}
SYMATTR InstName X21
SYMBOL TOF\\3Phase\\SVM\\DT_driver 736 800 R0
WINDOW 39 -11 73 Bottom 2
SYMATTR SpiceLine DT={DT}
SYMATTR InstName X22
SYMBOL TOF\\3Phase\\SVM\\DT_driver 736 624 R0
WINDOW 39 -11 73 Bottom 2
SYMATTR SpiceLine DT={DT}
SYMATTR InstName X23
SYMBOL voltage 1536 1728 M0
WINDOW 123 0 0 Left 0
WINDOW 39 0 0 Left 0
WINDOW 0 -77 38 Left 2
WINDOW 3 -566 70 Left 2
SYMATTR InstName V2
SYMATTR Value PULSE(0.5 0 0 {Tsw/2} {Tsw/2} 1p {Tsw})
SYMBOL e -80 1536 R0
WINDOW 0 45 42 Left 2
WINDOW 3 47 66 Left 2
SYMATTR InstName E7
SYMATTR Value {Fline}
SYMBOL e -80 1728 R0
WINDOW 0 45 42 Left 2
WINDOW 3 47 66 Left 2
SYMATTR InstName E8
SYMATTR Value {Fline}
SYMBOL e 624 1536 R0
WINDOW 0 45 42 Left 2
WINDOW 3 47 66 Left 2
SYMATTR InstName E9
SYMATTR Value {Fline}
SYMBOL e 624 1728 R0
WINDOW 0 45 42 Left 2
WINDOW 3 47 66 Left 2
SYMATTR InstName E10
SYMATTR Value {Fline}
SYMBOL e 1344 1536 R0
WINDOW 0 45 42 Left 2
WINDOW 3 47 66 Left 2
SYMATTR InstName E11
SYMATTR Value {Fline}
SYMBOL e 1344 1728 R0
WINDOW 0 45 42 Left 2
WINDOW 3 47 66 Left 2
SYMATTR InstName E12
SYMATTR Value {Fline}
SYMBOL TOF\\3Phase\\SVM\\COMPTOF 976 1504 R0
SYMATTR InstName X7
SYMATTR SpiceLine VHIGH=5 VLOW=100m VHYS=10m
SYMBOL TOF\\3Phase\\SVM\\COMPTOF 256 1504 R0
SYMATTR InstName X8
SYMATTR SpiceLine VHIGH=5 VLOW=100m VHYS=10m
SYMBOL TOF\\3Phase\\SVM\\COMPTOF 256 1696 R0
SYMATTR InstName X9
SYMATTR SpiceLine VHIGH=5 VLOW=100m VHYS=10m
SYMBOL TOF\\3Phase\\SVM\\COMPTOF 976 1696 R0
SYMATTR InstName X10
SYMATTR SpiceLine VHIGH=5 VLOW=100m VHYS=10m
SYMBOL TOF\\3Phase\\SVM\\COMPTOF 1728 1504 R0
SYMATTR InstName X11
SYMATTR SpiceLine VHIGH=5 VLOW=100m VHYS=10m
SYMBOL TOF\\3Phase\\SVM\\COMPTOF 1728 1696 R0
SYMATTR InstName X12
SYMATTR SpiceLine VHIGH=5 VLOW=100m VHYS=10m
SYMBOL TOF\\3Phase\\SVM\\AlphaBetaTimings 832 1184 R0
WINDOW 0 -160 -182 Bottom 2
SYMATTR InstName X2
SYMATTR SpiceLine Tsw={Tsw} Tref={Tref} K1=1
SYMBOL res 1904 208 M90
WINDOW 0 0 56 VBottom 2
WINDOW 3 32 56 VTop 2
SYMATTR InstName R1
SYMATTR Value 1k
SYMBOL cap 1920 272 M0
WINDOW 0 44 17 Left 2
WINDOW 3 42 44 Left 2
SYMATTR InstName C1
SYMATTR Value 150p
SYMBOL bv 2032 240 M0
WINDOW 0 -87 43 Left 2
WINDOW 3 -175 73 Left 2
SYMATTR InstName B1
SYMATTR Value V=V(pa,pb)
SYMBOL res 1904 480 M90
WINDOW 0 0 56 VBottom 2
WINDOW 3 32 56 VTop 2
SYMATTR InstName R2
SYMATTR Value 1k
SYMBOL cap 1920 544 M0
WINDOW 0 37 16 Left 2
WINDOW 3 38 44 Left 2
SYMATTR InstName C2
SYMATTR Value 150p
SYMBOL bv 2032 512 M0
WINDOW 0 -87 43 Left 2
WINDOW 3 -177 69 Left 2
SYMATTR InstName B2
SYMATTR Value V=V(pb,pc)
SYMBOL res 1904 736 M90
WINDOW 0 0 56 VBottom 2
WINDOW 3 32 56 VTop 2
SYMATTR InstName R3
SYMATTR Value 1k
SYMBOL cap 1920 800 M0
WINDOW 0 51 17 Left 2
WINDOW 3 49 43 Left 2
SYMATTR InstName C6
SYMATTR Value 150p
SYMBOL bv 2032 768 M0
WINDOW 0 -87 43 Left 2
WINDOW 3 -171 68 Left 2
SYMATTR InstName B3
SYMATTR Value V=V(pc,pa)
SYMBOL res 2384 208 M90
WINDOW 0 0 56 VBottom 2
WINDOW 3 32 56 VTop 2
SYMATTR InstName R4
SYMATTR Value 1k
SYMBOL cap 2400 272 M0
WINDOW 0 44 17 Left 2
WINDOW 3 42 44 Left 2
SYMATTR InstName C7
SYMATTR Value 150p
SYMBOL bv 2512 240 M0
WINDOW 0 -87 43 Left 2
WINDOW 3 -214 75 Left 2
SYMATTR InstName B4
SYMATTR Value V=V(pa,vo_2)
SYMBOL res 2384 480 M90
WINDOW 0 0 56 VBottom 2
WINDOW 3 32 56 VTop 2
SYMATTR InstName R5
SYMATTR Value 1k
SYMBOL cap 2400 544 M0
WINDOW 0 37 16 Left 2
WINDOW 3 38 44 Left 2
SYMATTR InstName C8
SYMATTR Value 150p
SYMBOL bv 2512 512 M0
WINDOW 0 -87 43 Left 2
WINDOW 3 -216 72 Left 2
SYMATTR InstName B5
SYMATTR Value V=V(pb,vo_2)
SYMBOL res 2384 736 M90
WINDOW 0 0 56 VBottom 2
WINDOW 3 32 56 VTop 2
SYMATTR InstName R6
SYMATTR Value 1k
SYMBOL cap 2400 800 M0
WINDOW 0 51 17 Left 2
WINDOW 3 49 43 Left 2
SYMATTR InstName C9
SYMATTR Value 150p
SYMBOL bv 2512 768 M0
WINDOW 0 -87 43 Left 2
WINDOW 3 -214 68 Left 2
SYMATTR InstName B6
SYMATTR Value V=V(pc,vo_2)
SYMBOL TOF\\3Phase\\SVM\\abc_alpha_beta 320 1136 R0
SYMATTR InstName X1
TEXT 1016 -144 Left 2 !*\n.MODEL TOFSW SW(Ron=25m Roff=10Meg Vt=2 Vh=1)\n.MODEL TOFGATE SW(Ron=10m Roff=10Meg Vt=2 Vh=1)\n.model TOFD D(IS=23.367E-18 N=.9983 RS=77.399E-3 IKF=1.0000E3 CJO=453.20E-12 M=.44242\n+ VJ=1.3170 ISR=31.573E-9 NR=2.4162 TT=0 XTI=2 EG=3.26 FC=0.5)\n; STPSC10H12CWL\n*\n; .MODEL TOFD D(IS=10e-18 RS=16m CJO=500p \n; +M=0.4 VJ=0.75 ISR=720n BV=1200 IBV=100u TT=130n)\n*
TEXT 1016 -240 Left 2 !.tran 0 160m 60m uic
TEXT 1016 -216 Left 2 !.options abstol=10u vntol=10m reltol=0.01 gmin=1n\n+method=gear
TEXT 1624 1032 Left 2 !*\n.param Fline=50 ; reference frequency\n.param Tref={1/Fline} ; reference time for ta, tb and tc\n.param Vgrms=230 ; reference voltage\n.param Vgpeak={Vgrms*sqrt(2)}\n.param Vdc=800\n.param Fsw=30k ; switching frequency\n.param Tsw={1/Fsw}\n.param DT=100n ; deadtime between S1/S3 and S2/S4\n*
TEXT 472 -64 Left 2 !.four 50 10 -1 I(Via)\n.four 50 10 -1 I(Vib)\n.four 50 10 -1 I(Vic)

The netlist it stands for:
* 3-phase NPC open loop inverter with switches - SVM.asc
rla pa N007 2
rlb pb N008 2
rlc pc N009 2
VIa N010 N007 0
VIb N011 N008 0
VIc N012 N009 0
SWa1 N001 Vout Ga1 0 TOFSW
D1 N001 Vout TOFD
SWa2 pa N001 Ga2 0 TOFSW
D7 pa N001 TOFD
SWa3 N004 pa Ga3 0 TOFSW
D2 N004 pa TOFD
SWa4 0 N004 Ga4 0 TOFSW
D8 0 N004 TOFD
D9 Vo_2 N001 TOFD
D10 N004 Vo_2 TOFD
D3 N002 Vout TOFD
D4 pb N002 TOFD
D5 N005 pb TOFD
D6 0 N005 TOFD
D11 Vo_2 N002 TOFD
D12 N005 Vo_2 TOFD
D13 N003 Vout TOFD
D14 pc N003 TOFD
D15 N006 pc TOFD
D16 0 N006 TOFD
D17 Vo_2 N003 TOFD
D18 N006 Vo_2 TOFD
SWb1 N002 Vout Gb1 0 TOFSW
SWb2 pb N002 Gb2 0 TOFSW
SWb3 N005 pb Gb3 0 TOFSW
SWb4 0 N005 Gb4 0 TOFSW
SWc1 N003 Vout Gc1 0 TOFSW
SWc2 pc N003 Gc2 0 TOFSW
SWc3 N006 pc Gc3 0 TOFSW
SWc4 0 N006 Gc4 0 TOFSW
V7 Vout Vo_2 {Vdc/2}
V8 Vo_2 0 {Vdc/2}
L1 N010 NN 10m
L2 N011 NN 10m
L3 N012 NN 10m
R7 phase_a N013 1k
C3 phase_a 0 150p
B52 N013 0 V=V(pa,NN)
R8 phase_b N016 1k
C4 phase_b 0 150p
B53 N016 0 V=V(pb,NN)
R9 phase_c N019 1k
C5 phase_c 0 150p
B54 N019 0 V=V(pc,NN)
Va1 va 0 SINE(0 {Vgpeak} {FLINE})
Vb1 vb 0 SINE(0 {Vgpeak} {FLINE} 0 0 -120)
Vc1 vc 0 SINE(0 {Vgpeak} {FLINE} 0 0 120)
X§X17 N023 N025 N026 N028 N029 N031 N032 N033 N034 N035 G1a G1b G1c G2a G2b G2c ta tb tc timinggenerator params: Tsw={Tsw} Tref={Tref}
X§X16 Q13a Ga1 Ga3 dt_driver params: DT={DT}
X§X19 Q24a Ga2 Ga4 dt_driver params: DT={DT}
X§X20 Q13b Gb1 Gb3 dt_driver params: DT={DT}
X§X21 Q24b Gb2 Gb4 dt_driver params: DT={DT}
X§X22 Q24c Gc2 Gc4 dt_driver params: DT={DT}
X§X23 Q13c Gc1 Gc3 dt_driver params: DT={DT}
V2 N036 0 PULSE(0.5 0 0 {Tsw/2} {Tsw/2} 1p {Tsw})
E7 N037 0 G1a 0 {Fline}
E8 N040 0 G2a 0 {Fline}
E9 N038 0 G1b 0 {Fline}
E10 N041 0 G2b 0 {Fline}
E11 N039 0 G1c 0 {Fline}
E12 N042 0 G2c 0 {Fline}
X§X7 N036 N038 Q13b comptof params: VHIGH=5 VLOW=100m VHYS=10m
X§X8 N036 N037 Q13a comptof params: VHIGH=5 VLOW=100m VHYS=10m
X§X9 N036 N040 Q24a comptof params: VHIGH=5 VLOW=100m VHYS=10m
X§X10 N036 N041 Q24b comptof params: VHIGH=5 VLOW=100m VHYS=10m
X§X11 N036 N039 Q13c comptof params: VHIGH=5 VLOW=100m VHYS=10m
X§X12 N036 N042 Q24c comptof params: VHIGH=5 VLOW=100m VHYS=10m
X§X2 N024 N027 N023 N025 N026 N028 N029 N031 N022 N032 N033 N034 N035 N030 ta tb tc alphabetatimings params: Tsw={Tsw} Tref={Tref} K1=1
R1 phase_ab N014 1k
C1 phase_ab 0 150p
B1 N014 0 V=V(pa,pb)
R2 phase_bc N017 1k
C2 phase_bc 0 150p
B2 N017 0 V=V(pb,pc)
R3 phase_ca N020 1k
C6 phase_ca 0 150p
B3 N020 0 V=V(pc,pa)
R4 PhaseA N015 1k
C7 PhaseA 0 150p
B4 N015 0 V=V(pa,vo_2)
R5 PhaseB N018 1k
C8 PhaseB 0 150p
B5 N018 0 V=V(pb,vo_2)
R6 PhaseC N021 1k
C9 PhaseC 0 150p
B6 N021 0 V=V(pc,vo_2)
X§X1 va vb vc 0 N024 N027 zero abc_alpha_beta

* block symbol definitions
.subckt timinggenerator R1 R2 R3 R4 R5 R6 RS1 RS2 RS3 RS4 G1a G1b G1c G2a G2b G2c ta tb tc
B1 s1a 0 V=If (V(RS1)>2.5, V(ta)/4+V(tc)/4+V(tb)/4, If (V(RS2)>2.5, V(ta)/4+V(tc)/4+V(tb)/2, If (V(RS3)>2.5, V(ta)/4+V(tc)/2+V(tb)/2, If (V(RS4)>2.5, V(ta)/2+V(tc)/4+V(tb)/2,0 ))))
B2 s2a 0 V=If (V(RS1)>2.5, V(ta)/2+V(tc)/2+V(tb)/4+V(tb)/2, If (V(RS2)>2.5, V(ta)/2+V(tb)/2+V(tc)/2, If (V(RS3)>2.5, V(ta)/2+V(tc)/2+V(tb)/2, If (V(RS4)>2.5, V(ta)/2+V(tc)/2+V(tb)/2,0 ))))
B3 s1b 0 V=If (V(RS1)>2.5, V(tc)/4+V(tb)/4, If (V(RS2)>2.5, V(tc)/4, If (V(RS3)>2.5, 0, If (V(RS4)>2.5, V(ta)/2+V(tc)/4,0 ))))
B4 s2b 0 V=If (V(RS1)>2.5, V(ta)/4+V(tc)/2+V(tb)/4+V(tb)/2, If (V(RS2)>2.5, V(ta)/4+V(tb)/2+V(tc)/2, If (V(RS3)>2.5, V(ta)/4+V(tb)/2, If (V(RS4)>2.5, V(ta)/2+V(tc)/2+V(tb)/2,0 ))))
B5 s1c 0 V=If (V(RS1)>2.5, V(tb)/4, If (V(RS2)>2.5, 0, If (V(RS3)>2.5, 0, If (V(RS4)>2.5, 0,0 ))))
B6 s2c 0 V=If (V(RS1)>2.5, V(ta)/4+V(tc)/4+V(tb)/4+V(tb)/2, If (V(RS2)>2.5, V(ta)/4+V(tc)/4, If (V(RS3)>2.5, V(ta)/4, If (V(RS4)>2.5, V(tc)/4,0 ))))
B7 G1a 0 V=If (V(R1)>2.5, V(S1a), IF ( V(R2)>2.5, {Tref}/2-V(s2b), IF (V(R3)>2.5, V(s1c), IF (V(R4)>2.5, {Tref}/2-V(s2a), IF (V(R5)>2.5, V(S1b), IF (V(R6)>2.5, {Tref}/2-V(s2c),0 ))))))
B8 G2a 0 V=If (V(R1)>2.5, V(S2a), IF ( V(R2)>2.5, {Tref}/2-V(s1b), IF (V(R3)>2.5, V(s2c), IF (V(R4)>2.5, {Tref}/2-V(s1a), IF (V(R5)>2.5, V(S2b), IF (V(R6)>2.5, {Tref}/2-V(s1c),0 ))))))
B9 G1b 0 V=If (V(R1)>2.5, V(S1b), IF ( V(R2)>2.5, {Tref}/2-V(s2c), IF (V(R3)>2.5, V(s1a), IF (V(R4)>2.5, {Tref}/2-V(s2b), IF (V(R5)>2.5, V(S1c), IF (V(R6)>2.5, {Tref}/2-V(s2a),0 ))))))
B10 G2b 0 V=If (V(R1)>2.5, V(S2b), IF ( V(R2)>2.5, {Tref}/2-V(s1c), IF (V(R3)>2.5, V(s2a), IF (V(R4)>2.5, {Tref}/2-V(s1b), IF (V(R5)>2.5, V(S2c), IF (V(R6)>2.5, {Tref}/2-V(s1a),0 ))))))
B11 G1c 0 V=If (V(R1)>2.5, V(S1c), IF ( V(R2)>2.5, {Tref}/2-V(s2a), IF (V(R3)>2.5, V(s1b), IF (V(R4)>2.5, {Tref}/2-V(s2c), IF (V(R5)>2.5, V(S1a), IF (V(R6)>2.5, {Tref}/2-V(s2b),0 ))))))
B12 G2c 0 V=If (V(R1)>2.5, V(S2c), IF ( V(R2)>2.5, {Tref}/2-V(s1a), IF (V(R3)>2.5, V(s2b), IF (V(R4)>2.5, {Tref}/2-V(s1c), IF (V(R5)>2.5, V(S2a), IF (V(R6)>2.5, {Tref}/2-V(s1b),0 ))))))
R1 RS1 0 1Meg
R2 RS2 0 1Meg
R3 RS3 0 1Meg
R4 RS4 0 1Meg
R5 R1 0 1Meg
R6 R2 0 1Meg
R7 R3 0 1Meg
R8 R4 0 1Meg
R9 R5 0 1Meg
R10 R6 0 1Meg
R11 ta 0 1Meg
R12 tb 0 1Meg
R13 tc 0 1Meg
* Timing patterns to form the various + - 0 states (P N 0)
* for sub-regions 1 to 4.
.ends timinggenerator

.subckt dt_driver IN OutN OutP
A1 IN 0 0 0 0 N004 N001 0 BUF Vhigh=5 Vlow=0 Ref=1.0
R1 N003 N001 1k
C1 N003 0 {CDT}
R2 N006 N004 1k
C2 N006 0 {CDT}
A2 0 N001 0 N003 0 0 N002 0 AND Vhigh=5 Vlow=0 Ref=2.5
A3 0 N004 0 N006 0 0 N005 0 AND Vhigh=5 Vlow=0 Ref=2.5
D1 N003 N001 1N4148
D2 N006 N004 D
R3 OutN N002 10
R4 OutP N005 10
C3 OutN 0 10p
C4 OutP 0 10p
.param CDT={DT/(0.691*1k)}
.ends dt_driver

.subckt comptof INV NINV OUT
B1 HYS NINV V=IF(V(out) > ({VHIGH}+{VLOW})/2,{VHYS},0)
B2 N001 0 V=IF(V(HYS,INV)>0,{VHIGH},{VLOW})
R1 N001 OUT 10
C1 OUT 0 10p
R2 INV 0 1Meg
.ends comptof

.subckt alphabetatimings Alpha Beta R1 R2 R3 R4 R5 R6 RegionV RS1 RS2 RS3 RS4 SectorV ta tb tc
B1 Ref 0 V=(sqrt(V(alpha)**2+V(beta)**2))
B2 Theta 0 V=(atan2(V(beta),V(alpha)))
B3 AngleD 0 V=(atan2(V(beta),V(alpha)))*180/pi
R1 Alpha 0 1Meg
R2 Beta 0 1Meg
B4 RS1 0 V=If( (V(m1)<0.5 ) & (V(m2)<0.5) & (V(sum_m12)<0.5), 5,0 )
B5 RS2 0 V=If( (V(m1)<0.5 ) & (V(m2)<0.5) & (V(sum_m12)>0.5), 5,0 )
B6 RS3 0 V=If( V(m1)>0.5, 5,0 )
B7 RS4 0 V=If( V(m2)>0.5, 5,0 )
B8 m1 0 V=V(mn)*(cos(V(thetaS))-sin(V(thetaS))/sqrt(3))
B9 mn 0 V=V(ref)*1.5/{Vdc}
B10 m2 0 V=(2*V(mn)/sqrt(3))*sin(V(thetaS))
B11 sum_m12 0 V=V(m1)+V(m2)
B12 R1 0 V=IF ( (V(AngleD)>0) & (V(AngleD)<60), 5, 0 )
B13 R3 0 V=IF ( (V(AngleD)>120) & (V(AngleD)<180), 5, 0 )
B14 R5 0 V=IF ( (V(AngleD)>-120) & (V(AngleD)<-60), 5, 0 )
B15 R2 0 V=IF ( (V(AngleD)>60) & (V(AngleD)<120), 5, 0 )
B16 R4 0 V=IF ( (V(AngleD)>-180) & (V(AngleD)<-120), 5, 0 )
B17 R6 0 V=IF ( (V(AngleD)>-60) & (V(AngleD)<0), 5, 0 )
B18 ThetaS 0 V=If ( V(R2)>2.5,V(theta)-pi/3, if (V(R3)>2.5,V(theta)-2*pi/3, If ( V(R4)>2.5,V(theta)+pi, If ( V(R5)>2.5,V(theta)+2*pi/3 , if ( V(R6)>2.55,V(theta)+pi/3, V(theta) )))))
B19 ThetaSD 0 V=V(ThetaS)*180/pi
B20 ta1 0 V=4*V(mn)*{Tref}*sin(pi/3-V(ThetaS))/sqrt(3)
B21 ta3 0 V=2*{Tref}-4*V(mn)*{Tref}*sin(V(ThetaS)+pi/3)/sqrt(3)
B22 ta2 0 V={Tref}-4*V(mn)*{Tref}*sin(V(ThetaS))/sqrt(3)
B23 ta4 0 V=4*V(mn)*{Tref}*sin(V(ThetaS))/sqrt(3)-{Tref}
B24 tb1 0 V={Tref}-4*V(mn)*{Tref}*sin(V(ThetaS)+pi/3)/sqrt(3)
B25 tb3 0 V=4*V(mn)*{Tref}*sin(V(ThetaS))/sqrt(3)
B26 tb2 0 V=4*V(mn)*{Tref}*sin(V(ThetaS)+pi/3)/sqrt(3)-{Tref}
B27 tb4 0 V=4*V(mn)*{Tref}*sin(pi/3-V(ThetaS))/sqrt(3)
B28 tc1 0 V=4*V(mn)*{Tref}*sin(V(ThetaS))/sqrt(3)
B29 tc3 0 V=4*V(mn)*{Tref}*sin(pi/3-V(ThetaS))/sqrt(3)-{Tref}
B30 tc2 0 V={Tref}-4*V(mn)*{Tref}*sin(pi/3-V(ThetaS))/sqrt(3)
B31 tc4 0 V=2*{Tref}-4*V(mn)*{Tref}*sin(V(ThetaS)+pi/3)/sqrt(3)
B32 TswTEST 0 V=V(ta)+V(tb)+V(tc)
B33 SectorV 0 V=IF (V(R1)>2.5,1, IF ( V(R2)>2.5,2, IF (V(R3)>2.5,3, IF (V(R4)>2.5, 4, IF (V(R5)>2.5,5, IF (V(R6)>2.5,6,0))))))
B34 RegionV 0 V=IF (V(RS1)>2.5,1, IF ( V(RS2)>2.5,2, IF (V(RS3)>2.5,3, IF (V(RS4)>2.5,4,0))))
B38 ta 0 V=IF (V(Nta)>{Tref},{Tref}, IF (V(Nta)<0,0,V(Nta) ))
B39 tb 0 V=IF (V(Ntb)>{Tref},{Tref}, IF (V(Ntb)<0,0,V(Ntb) ))
B40 tc 0 V=IF (V(Ntc)>{Tref},{Tref}, IF (V(Ntc)<0,0,V(Ntc) ))
B41 NTa 0 V=IF (V(RS1)>2.5,V(Ta1), IF ( V(RS2)>2.5,V(Ta2), IF (V(RS3)>2.5,V(Ta3), IF (V(RS4)>2.5, V(Ta4), 0 ))))
B42 NTb 0 V=IF (V(RS1)>2.5,V(Tb1), IF ( V(RS2)>2.5,V(Tb2), IF (V(RS3)>2.5,V(Tb3), IF (V(RS4)>2.5, V(Tb4), 0 ))))
B43 NTc 0 V=IF (V(RS1)>2.5,V(Tc1), IF ( V(RS2)>2.5,V(Tc2), IF (V(RS3)>2.5,V(Tc3), IF (V(RS4)>2.5, V(Tc4), 0 ))))
B35 m2a 0 V=(2*V(mn)*sin(V(theta)-(V(sectorV)-1)*(pi/3)))/sqrt(3)
B36 m1a 0 V=(2*V(mn)*sin(V(sectorV)*pi/3-V(theta)))/sqrt(3)
* Angle in radians
* Magnitude of the reference vector to be synthesized
* Angle in degrees
* Sub-region 1-4 determination
* m1 calculation
* m2 calculation
* Region 1-6 determination
* This is the modulation index
* Brings any angle from the reference vector to an
* angle located in sector 1 - from 0 to 60° or 0 to pi/3
* ThetaS in degrees
* Timings for ta, tb and tc selected based on the sub-region 1 to 4.
* Plots the sector depending on the reference angle
* Plots the sub-triangle and region 1-4 depending
* on the vectors to be synthesized (LV, SV, MV, Zero).
.MODEL TOFGATE SW(Ron=100m Roff=100Meg Vt=2 Vh=1)
* alternate implementation
* alternate implementation
.ends alphabetatimings

.subckt abc_alpha_beta a b c N Alpha Beta I0
R1 a 0 1Meg
R2 b 0 1Meg
R3 c 0 1Meg
B1 N001 0 V=(V(a,N)/sqrt(2)+V(b,N)/sqrt(2)+V(c,N)/sqrt(2))*sqrt(2/3)
B2 N002 0 V=(V(a,N)-0.5*V(b,N)-0.5*V(c,N))*sqrt(2/3)
B3 N003 0 V=(sqrt(3)*V(b,N)/2-sqrt(3)*V(c,N)/2)*sqrt(2/3)
R5 I0 N001 1k
R6 N002 Alpha 1k
R7 N003 Beta 1k
C1 I0 0 1n
C2 Alpha 0 1n
C3 Beta 0 1n
R4 N 0 1Meg
.ends abc_alpha_beta

.model D D
.lib standard.dio
*
.MODEL TOFSW SW(Ron=25m Roff=10Meg Vt=2 Vh=1)
.MODEL TOFGATE SW(Ron=10m Roff=10Meg Vt=2 Vh=1)
.model TOFD D(IS=23.367E-18 N=.9983 RS=77.399E-3 IKF=1.0000E3 CJO=453.20E-12 M=.44242
+ VJ=1.3170 ISR=31.573E-9 NR=2.4162 TT=0 XTI=2 EG=3.26 FC=0.5)
; STPSC10H12CWL
*
; .MODEL TOFD D(IS=10e-18 RS=16m CJO=500p
; +M=0.4 VJ=0.75 ISR=720n BV=1200 IBV=100u TT=130n)
*
.tran 0 160m 60m uic
.options abstol=10u vntol=10m reltol=0.01 gmin=1n
+method=gear
*
.param Fline=50 ; reference frequency
.param Tref={1/Fline} ; reference time for ta, tb and tc
.param Vgrms=230 ; reference voltage
.param Vgpeak={Vgrms*sqrt(2)}
.param Vdc=800
.param Fsw=30k ; switching frequency
.param Tsw={1/Fsw}
.param DT=100n ; deadtime between S1/S3 and S2/S4
*
.four 50 10 -1 I(Via)
.four 50 10 -1 I(Vib)
.four 50 10 -1 I(Vic)
.backanno
.end